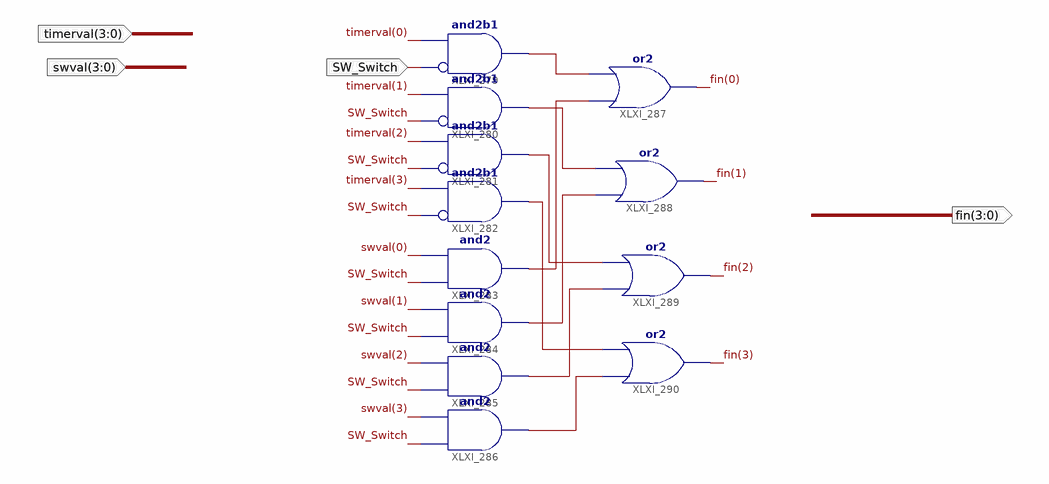
[diagram p0: schematic sheet 1]
// Xilinx ISE schematic Timer_SW_Select_bus.sch (spartan3e) as structural Verilog: 12 symbols, 4 ports
module Timer_SW_Select_bus (
  input  SW_Switch,
  input  [3:0] timerval,
  input  [3:0] swval,
  output [3:0] fin
);

  wire XLXN_723, XLXN_724, XLXN_725, XLXN_726, XLXN_727, XLXN_728, XLXN_729, XLXN_730;

  and XLXI_279 (XLXN_723, ~SW_Switch, timerval[0]);  // and2b1
  and XLXI_280 (XLXN_725, ~SW_Switch, timerval[1]);  // and2b1
  and XLXI_281 (XLXN_727, ~SW_Switch, timerval[2]);  // and2b1
  and XLXI_282 (XLXN_729, ~SW_Switch, timerval[3]);  // and2b1
  and XLXI_283 (XLXN_724, SW_Switch, swval[0]);
  and XLXI_284 (XLXN_726, SW_Switch, swval[1]);
  and XLXI_285 (XLXN_728, SW_Switch, swval[2]);
  and XLXI_286 (XLXN_730, SW_Switch, swval[3]);
  or XLXI_287 (fin[0], XLXN_724, XLXN_723);
  or XLXI_288 (fin[1], XLXN_726, XLXN_725);
  or XLXI_289 (fin[2], XLXN_728, XLXN_727);
  or XLXI_290 (fin[3], XLXN_730, XLXN_729);

  // Notes on the sheet:
  //   LOC on signal SW_Switch = P91
endmodule
